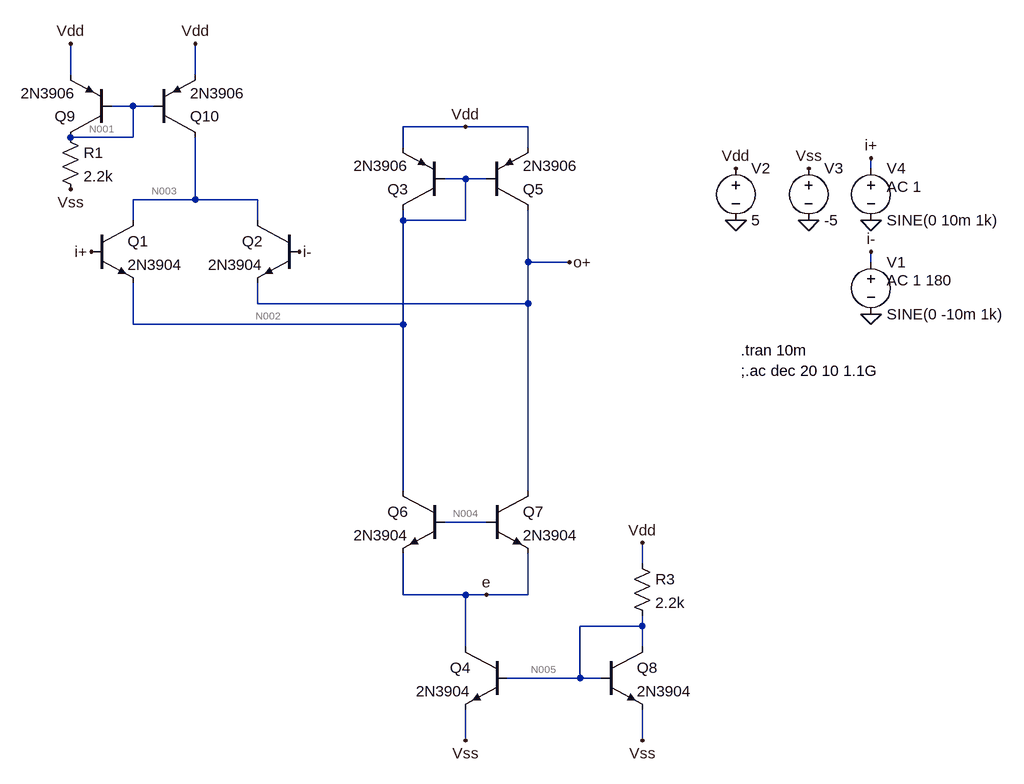
[diagram p0: schematic task1.asc]
task1.asc, the LTspice schematic file:
Version 4
SHEET 1 1288 680
WIRE -336 -800 -336 -848
WIRE -144 -800 -144 -848
WIRE -240 -752 -272 -752
WIRE -208 -752 -240 -752
WIRE 272 -720 176 -720
WIRE 368 -720 272 -720
WIRE -240 -704 -240 -752
WIRE -240 -704 -336 -704
WIRE 176 -688 176 -720
WIRE 368 -688 368 -720
WIRE 896 -656 896 -672
WIRE 272 -640 240 -640
WIRE 304 -640 272 -640
WIRE -144 -608 -144 -704
WIRE -144 -608 -240 -608
WIRE -48 -608 -144 -608
WIRE -240 -576 -240 -608
WIRE -48 -576 -48 -608
WIRE 176 -576 176 -592
WIRE 272 -576 272 -640
WIRE 272 -576 176 -576
WIRE 368 -512 368 -592
WIRE 432 -512 368 -512
WIRE 896 -512 896 -528
WIRE -48 -448 -48 -480
WIRE 368 -448 368 -512
WIRE 368 -448 -48 -448
WIRE -240 -416 -240 -480
WIRE 176 -416 176 -576
WIRE 176 -416 -240 -416
WIRE 176 -160 176 -416
WIRE 368 -160 368 -448
WIRE 304 -112 240 -112
WIRE 544 -48 544 -80
WIRE 176 0 176 -64
WIRE 272 0 176 0
WIRE 304 0 272 0
WIRE 368 0 368 -64
WIRE 368 0 304 0
WIRE 544 48 544 32
WIRE 544 48 448 48
WIRE 272 80 272 0
WIRE 544 80 544 48
WIRE 448 128 448 48
WIRE 448 128 336 128
WIRE 480 128 448 128
WIRE 272 224 272 176
WIRE 544 224 544 176
FLAG 896 -432 0
FLAG 688 -576 0
FLAG 896 -528 i-
FLAG 688 -656 Vdd
FLAG 800 -576 0
FLAG 800 -656 Vss
FLAG 896 -576 0
FLAG 896 -672 i+
FLAG 272 224 Vss
FLAG 304 0 e
FLAG 272 -720 Vdd
FLAG 16 -528 i-
FLAG -304 -528 i+
FLAG 432 -512 o+
FLAG 544 224 Vss
FLAG 544 -80 Vdd
FLAG -336 -848 Vdd
FLAG -336 -624 Vss
FLAG -144 -848 Vdd
SYMBOL voltage 896 -528 R0
WINDOW 123 24 44 Left 2
WINDOW 39 0 0 Left 0
SYMATTR Value2 AC 1 180
SYMATTR InstName V1
SYMATTR Value SINE(0 -10m 1k)
SYMBOL voltage 688 -672 R0
WINDOW 123 0 0 Left 0
WINDOW 39 0 0 Left 0
SYMATTR InstName V2
SYMATTR Value 5
SYMBOL npn -304 -576 R0
SYMATTR InstName Q1
SYMATTR Value 2N3904
SYMBOL voltage 800 -672 R0
WINDOW 123 0 0 Left 0
WINDOW 39 0 0 Left 0
SYMATTR InstName V3
SYMATTR Value -5
SYMBOL voltage 896 -672 R0
WINDOW 123 24 44 Left 2
WINDOW 39 0 0 Left 0
SYMATTR Value2 AC 1
SYMATTR InstName V4
SYMATTR Value SINE(0 10m 1k)
SYMBOL npn 16 -576 M0
SYMATTR InstName Q2
SYMATTR Value 2N3904
SYMBOL npn 336 80 M0
SYMATTR InstName Q4
SYMATTR Value 2N3904
SYMBOL pnp 240 -592 R180
SYMATTR InstName Q3
SYMATTR Value 2N3906
SYMBOL pnp 304 -592 M180
SYMATTR InstName Q5
SYMATTR Value 2N3906
SYMBOL npn 240 -160 M0
SYMATTR InstName Q6
SYMATTR Value 2N3904
SYMBOL npn 304 -160 R0
SYMATTR InstName Q7
SYMATTR Value 2N3904
SYMBOL npn 480 80 R0
SYMATTR InstName Q8
SYMATTR Value 2N3904
SYMBOL res 528 -64 R0
SYMATTR InstName R3
SYMATTR Value 2.2k
SYMBOL pnp -272 -704 R180
SYMATTR InstName Q9
SYMATTR Value 2N3906
SYMBOL pnp -208 -704 M180
SYMATTR InstName Q10
SYMATTR Value 2N3906
SYMBOL res -352 -720 R0
SYMATTR InstName R1
SYMATTR Value 2.2k
TEXT 696 -376 Left 2 !.tran 10m\n;.ac dec 20 10 1.1G

The netlist it stands for:
* task1.asc
V1 i- 0 SINE(0 -10m 1k) AC 1 180
V2 Vdd 0 5
Q1 N003 i+ N002 0 2N3904
V3 Vss 0 -5
V4 i+ 0 SINE(0 10m 1k) AC 1
Q2 N003 i- o+ 0 2N3904
Q4 e N005 Vss 0 2N3904
Q3 N002 N002 Vdd 0 2N3906
Q5 o+ N002 Vdd 0 2N3906
Q6 N002 N004 e 0 2N3904
Q7 o+ N004 e 0 2N3904
Q8 N005 N005 Vss 0 2N3904
R3 Vdd N005 2.2k
Q9 N001 N001 Vdd 0 2N3906
Q10 N003 N001 Vdd 0 2N3906
R1 N001 Vss 2.2k
.model NPN NPN
.model PNP PNP
.lib standard.bjt
.tran 10m
;.ac dec 20 10 1.1G
.backanno
.end

* Results of the author's LTspice run, read from the files saved beside the schematic
* Operating Point, zero values left out:
*   V(vdd) = 5 V
*   V(n003) = 4.994 V
*   V(n002) = 4.675 V
*   V(vss) = -5 V
*   V(o+) = 4.179 V
*   V(e) = -4.994 V
*   V(n005) = -4.31 V
*   V(n004) = -4.671 V
*   V(n001) = 4.31 V
*   Ic(Q10) = -9.992 pA
*   Ib(Q10) = -522.3 µA
*   Ie(Q10) = 522.3 µA
*   Ic(Q9) = -3.691 mA
*   Ib(Q9) = -18.62 µA
*   Ie(Q9) = 3.71 mA
*   Ic(Q5) = -2.879 nA
*   Ib(Q5) = -14.15 pA
*   Ie(Q5) = 2.894 nA
*   Ic(Q3) = -2.865 nA
*   Ib(Q3) = -14.65 pA
*   Ie(Q3) = 2.879 nA
*   Ic(Q8) = 3.701 mA
*   Ib(Q8) = 12.45 µA
*   Ie(Q8) = -3.713 mA
*   Ic(Q7) = 2.875 nA
*   Ie(Q7) = -2.876 nA
*   Ic(Q6) = 2.889 nA
*   Ie(Q6) = -2.889 nA
*   Ic(Q4) = 5.764 nA
*   Ib(Q4) = 518.6 µA
*   Ie(Q4) = -518.6 µA
*   Ic(Q2) = 4.992 pA
*   Ib(Q2) = -9.175 pA
*   Ie(Q2) = 4.183 pA
*   Ic(Q1) = 4.992 pA
*   Ib(Q1) = -9.672 pA
*   Ie(Q1) = 4.681 pA
*   I(R1) = 4.232 mA
*   I(R3) = 4.232 mA
*   I(V4) = 9.672 pA
*   I(V3) = 8.464 mA
*   I(V2) = -8.464 mA
*   I(V1) = 9.175 pA
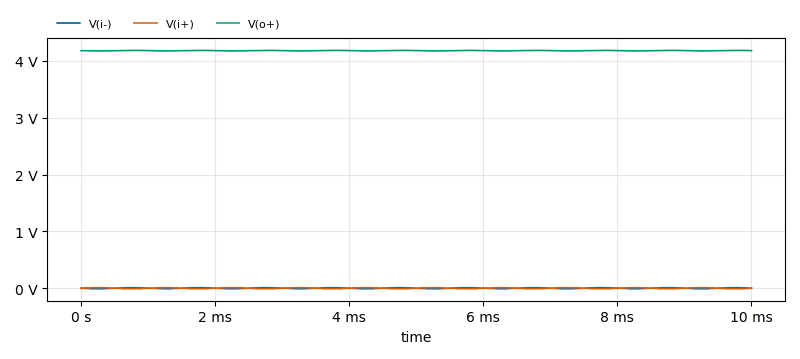
[diagram p1: Transient Analysis of task1.asc, plotted from the saved traces]
* Transient Analysis, 1 run:
*   V(i-): min -10 mV, max 10 mV, average 61.3 nV, rms 7.086 mV, last 0 V
*   V(i+): min -10 mV, max 10 mV, average -61.3 nV, rms 7.086 mV, last 0 V
*   V(o+): min 4.174 V, max 4.183 V, average 4.179 V, rms 4.179 V, last 4.179 V